# Altium schematic sheet 01_Power&USB.SchDoc
size A4
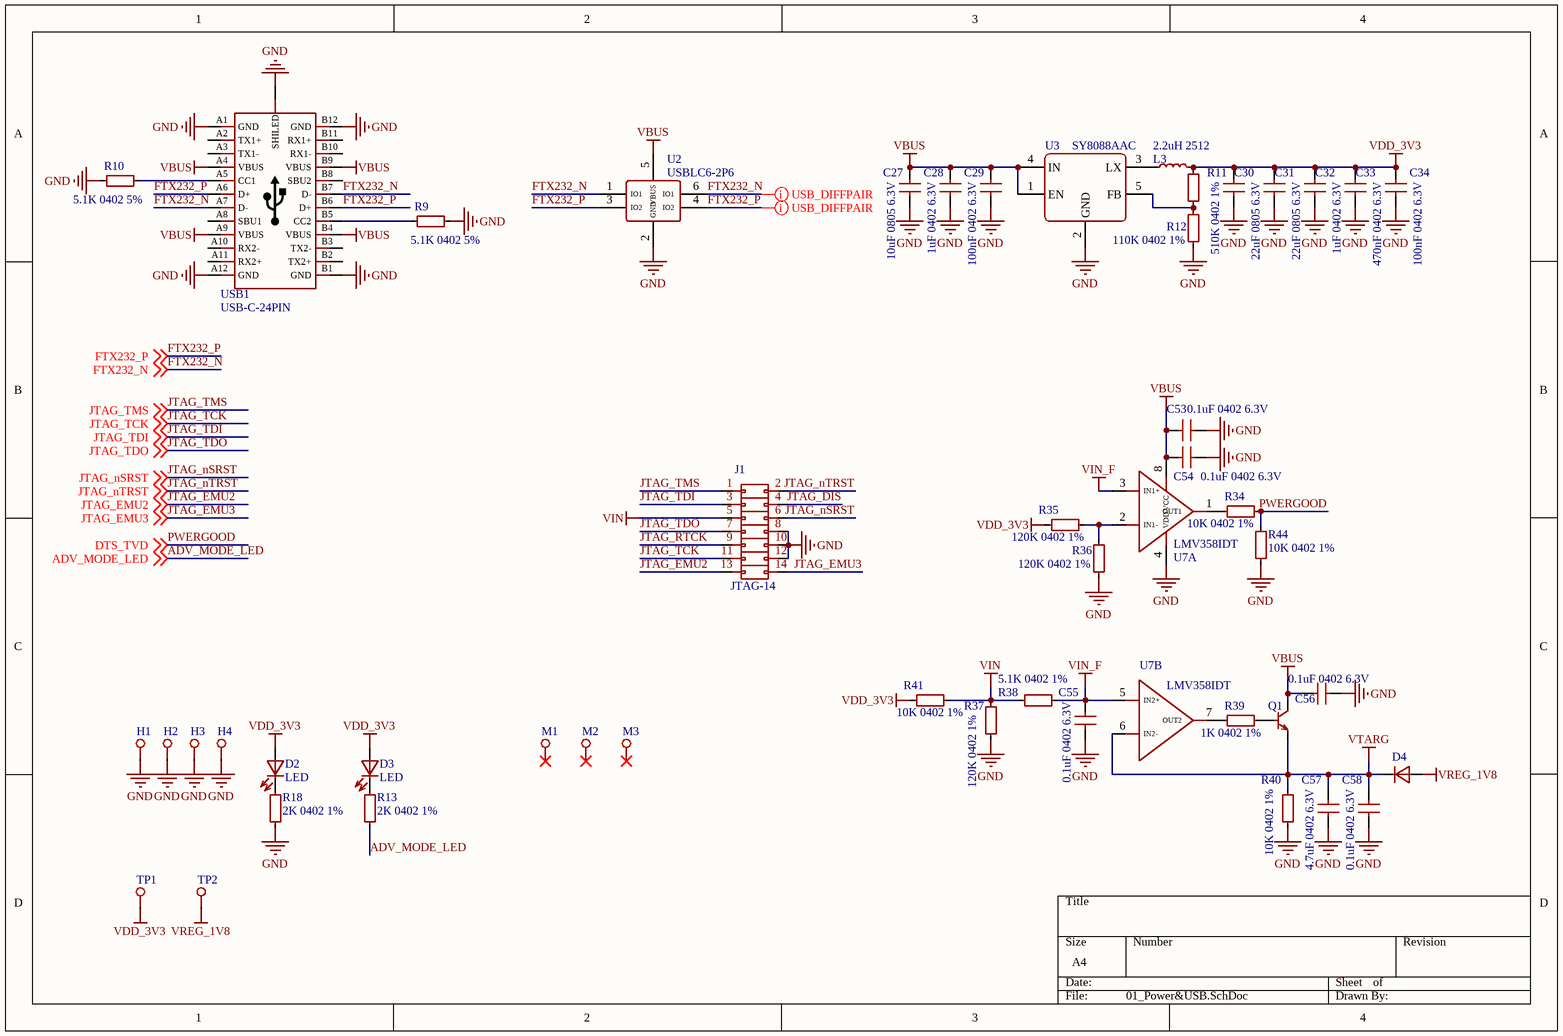
[diagram p0: 01_Power&USB.SchDoc]

## Parts
C27  10uF 0805 6.3V  [C_0805_2012Metric]
C28  1uF 0402 6.3V  [C_0402_1005Metric]
C29  100nF 0402 6.3V  [C_0402_1005Metric]
C30  22uF 0805 6.3V  [C_0805_2012Metric]
C31  22uF 0805 6.3V  [C_0805_2012Metric]
C32  1uF 0402 6.3V  [C_0402_1005Metric]
C33  470nF 0402 6.3V  [C_0402_1005Metric]
C34  100nF 0402 6.3V  [C_0402_1005Metric]
C53  0.1uF 0402 6.3V  [C_0402_1005Metric]
C54  0.1uF 0402 6.3V  [C_0402_1005Metric]
C55  0.1uF 0402 6.3V  [C_0402_1005Metric]
C56  0.1uF 0402 6.3V  [C_0402_1005Metric]
C57  4.7uF 0402 6.3V  [C_0402_1005Metric]
C58  0.1uF 0402 6.3V  [C_0402_1005Metric]
D2  LED  [LED_0603_1608Metric]
D3  LED  [LED_0603_1608Metric]
D4  Diode  [SOD-523F_0P9X1P3_ONS]  (value not drawn)
H1  TestPoint  [M2-HOLE]  (value not drawn)
H2  TestPoint  [M2-HOLE]  (value not drawn)
H3  TestPoint  [M2-HOLE]  (value not drawn)
H4  TestPoint  [M2-HOLE]  (value not drawn)
J1  JTAG-14  [DC3_14P_2.54MM_V]
L3  2.2uH 2512  [L_252012-TEMP]
M1  TestPoint  [Mark-1mm]  (value not drawn)
M2  TestPoint  [Mark-1mm]  (value not drawn)
M3  TestPoint  [Mark-1mm]  (value not drawn)
Q1  NPN-BEC  [NPN-BCE]  (value not drawn)
R9  5.1K 0402 5%  [R_0402_1005Metric]
R10  5.1K 0402 5%  [R_0402_1005Metric]
R11  510K 0402 1%  [R_0402_1005Metric]
R12  110K 0402 1%  [R_0402_1005Metric]
R13  2K 0402 1%  [R_0402_1005Metric]
R18  2K 0402 1%  [R_0402_1005Metric]
R34  10K 0402 1%  [R_0402_1005Metric]
R35  120K 0402 1%  [R_0402_1005Metric]
R36  120K 0402 1%  [R_0402_1005Metric]
R37  120K 0402 1%  [R_0402_1005Metric]
R38  5.1K 0402 1%  [R_0402_1005Metric]
R39  1K 0402 1%  [R_0402_1005Metric]
R40  10K 0402 1%  [R_0402_1005Metric]
R41  10K 0402 1%  [R_0402_1005Metric]
R44  10K 0402 1%  [R_0402_1005Metric]
TP1  TestPoint  [TP-60MIL]  (value not drawn)
TP2  TestPoint  [TP-60MIL]  (value not drawn)
U2  USBLC6-2P6  [USBLC6-2P6-SOT-563]
U3  SY8088AAC  [SY8088AAC]
U7  LMV358IDT  [LMV358IDT-SOP8]  (parts A,B of 2)
USB1  USB-C-24PIN  [TYPE-C-16P-N0-ME]

## Nets
GND: C27.1 C28.1 C29.1 C30.1 C31.1 C32.1 C33.1 C34.1 C53.2 C54.2 C55.2 C56.2 C57.1 C58.1 H1.1 H2.1 H3.1 H4.1 J1.8 J1.10 J1.12 R9.2 R10.1 R12.1 R18.2 R36.2 R37.2 R40.1 R44.2 U2.2(GND) U3.2(GND) U7.4(VDD) USB1.A1(GND) USB1.A12(GND) USB1.B1(GND) USB1.B12(GND) USB1.SHILED
VBUS: C27.2 C28.2 C29.2 C53.1 C54.1 C56.1 Q1.3(C) U2.5(VBUS) U3.1(EN) U3.4(IN) U7.8(VCC) USB1.A4(VBUS) USB1.A9(VBUS) USB1.B4(VBUS) USB1.B9(VBUS)
VDD_3V3: C30.2 C31.2 C32.2 C33.2 C34.2 D2.1 D3.1 L3.2 R11.2 R35.2 R41.2 TP1.1
VIN: J1.5 R37.1 R38.1 R41.1
VIN_F: C55.1 R38.2 U7.3(IN1+) U7.5(IN2+)
VREG_1V8: D4.1 TP2.1
VTARG: C57.2 C58.2 D4.2 Q1.2(E) R40.2 U7.6(IN2-)
ADV_MODE_LED: R13.2 ; off-sheet ADV_MODE_LED
FTX232_N: U2.1(IO1) U2.6(IO1) USB1.A7(D-) USB1.B7(D-) ; off-sheet FTX232_N
FTX232_P: U2.3(IO2) U2.4(IO2) USB1.A6(D+) USB1.B6(D+) ; off-sheet FTX232_P
JTAG_DIS: J1.4
JTAG_EMU2: J1.13 ; off-sheet JTAG_EMU2
JTAG_EMU3: J1.14 ; off-sheet JTAG_EMU3
JTAG_nSRST: J1.6 ; off-sheet JTAG_nSRST
JTAG_nTRST: J1.2 ; off-sheet JTAG_nTRST
JTAG_RTCK: J1.9
JTAG_TCK: J1.11 ; off-sheet JTAG_TCK
JTAG_TDI: J1.3 ; off-sheet JTAG_TDI
JTAG_TDO: J1.7 ; off-sheet JTAG_TDO
JTAG_TMS: J1.1 ; off-sheet JTAG_TMS
PWERGOOD: R34.1 R44.1 ; off-sheet DTS_TVD  [also labelled DTS_TVD]
NetD2_2: D2.2 R18.1
NetD3_2: D3.2 R13.1
NetL3_1: L3.1 U3.3(LX)
NetQ1_1: Q1.1(B) R39.2
NetR9_1: R9.1 USB1.B5(CC2)
NetR10_2: R10.2 USB1.A5(CC1)
NetR11_1: R11.1 R12.2 U3.5(FB)
NetR34_2: R34.2 U7.1(OUT1)
NetR35_1: R35.1 R36.1 U7.2(IN1-)
NetR39_1: R39.1 U7.7(OUT2)

Not connected (* = marked no-connect by the designer): M1 1*; M2 1*; M3 1*; USB1 A2(TX1+) A3(TX1-) A8(SBU1) A10(RX2-) A11(RX2+) B2(TX2+) B3(TX2-) B8(SBU2) B10(RX1-) B11(RX1+)

## Layout directives
differential pair: FTX232_N, FTX232_P

## Library data of the parts
C27-C34 C53-C58 = C: Unpolarized capacitor
D2 D3 = LED: Light emitting diode
D4 = Diode: Diode_AK
H1-H4 M1-M3 TP1 TP2 = TestPoint: test point tp
J1 = Generic_Conn_02x07: Generic connector, single row, 02x07,Odd Even
L3 = L: Inductor
Q1 = NPN-BEC: NPN transistor, base/collector/emitter for SOT23
R9-R13 R18 R34-R41 R44 = R: Resistor
U2 = USBLC6-2P6: Low Capacitance 2-Line ESD Protection
U3 = SY8088AAC: High Efficiency 1.5MHz, 1A / Synchronous Step Down Regulator
U7 = LMV358IDT: Low cost, low power, input/output rail-to-rail operational amplifiers